# EasyEDA Pro project ProProject_ONGEKI霍尔按键.epro

# Schematic Schematic1
Create Date: 2024-01-17; Page Name: P1; Project Name: ONGEKI霍尔按键; Schematic Name: Schematic1; Update Date: 2024-01-17; Company: 嘉立创EDA; Page Size: A4; Version: V1.0
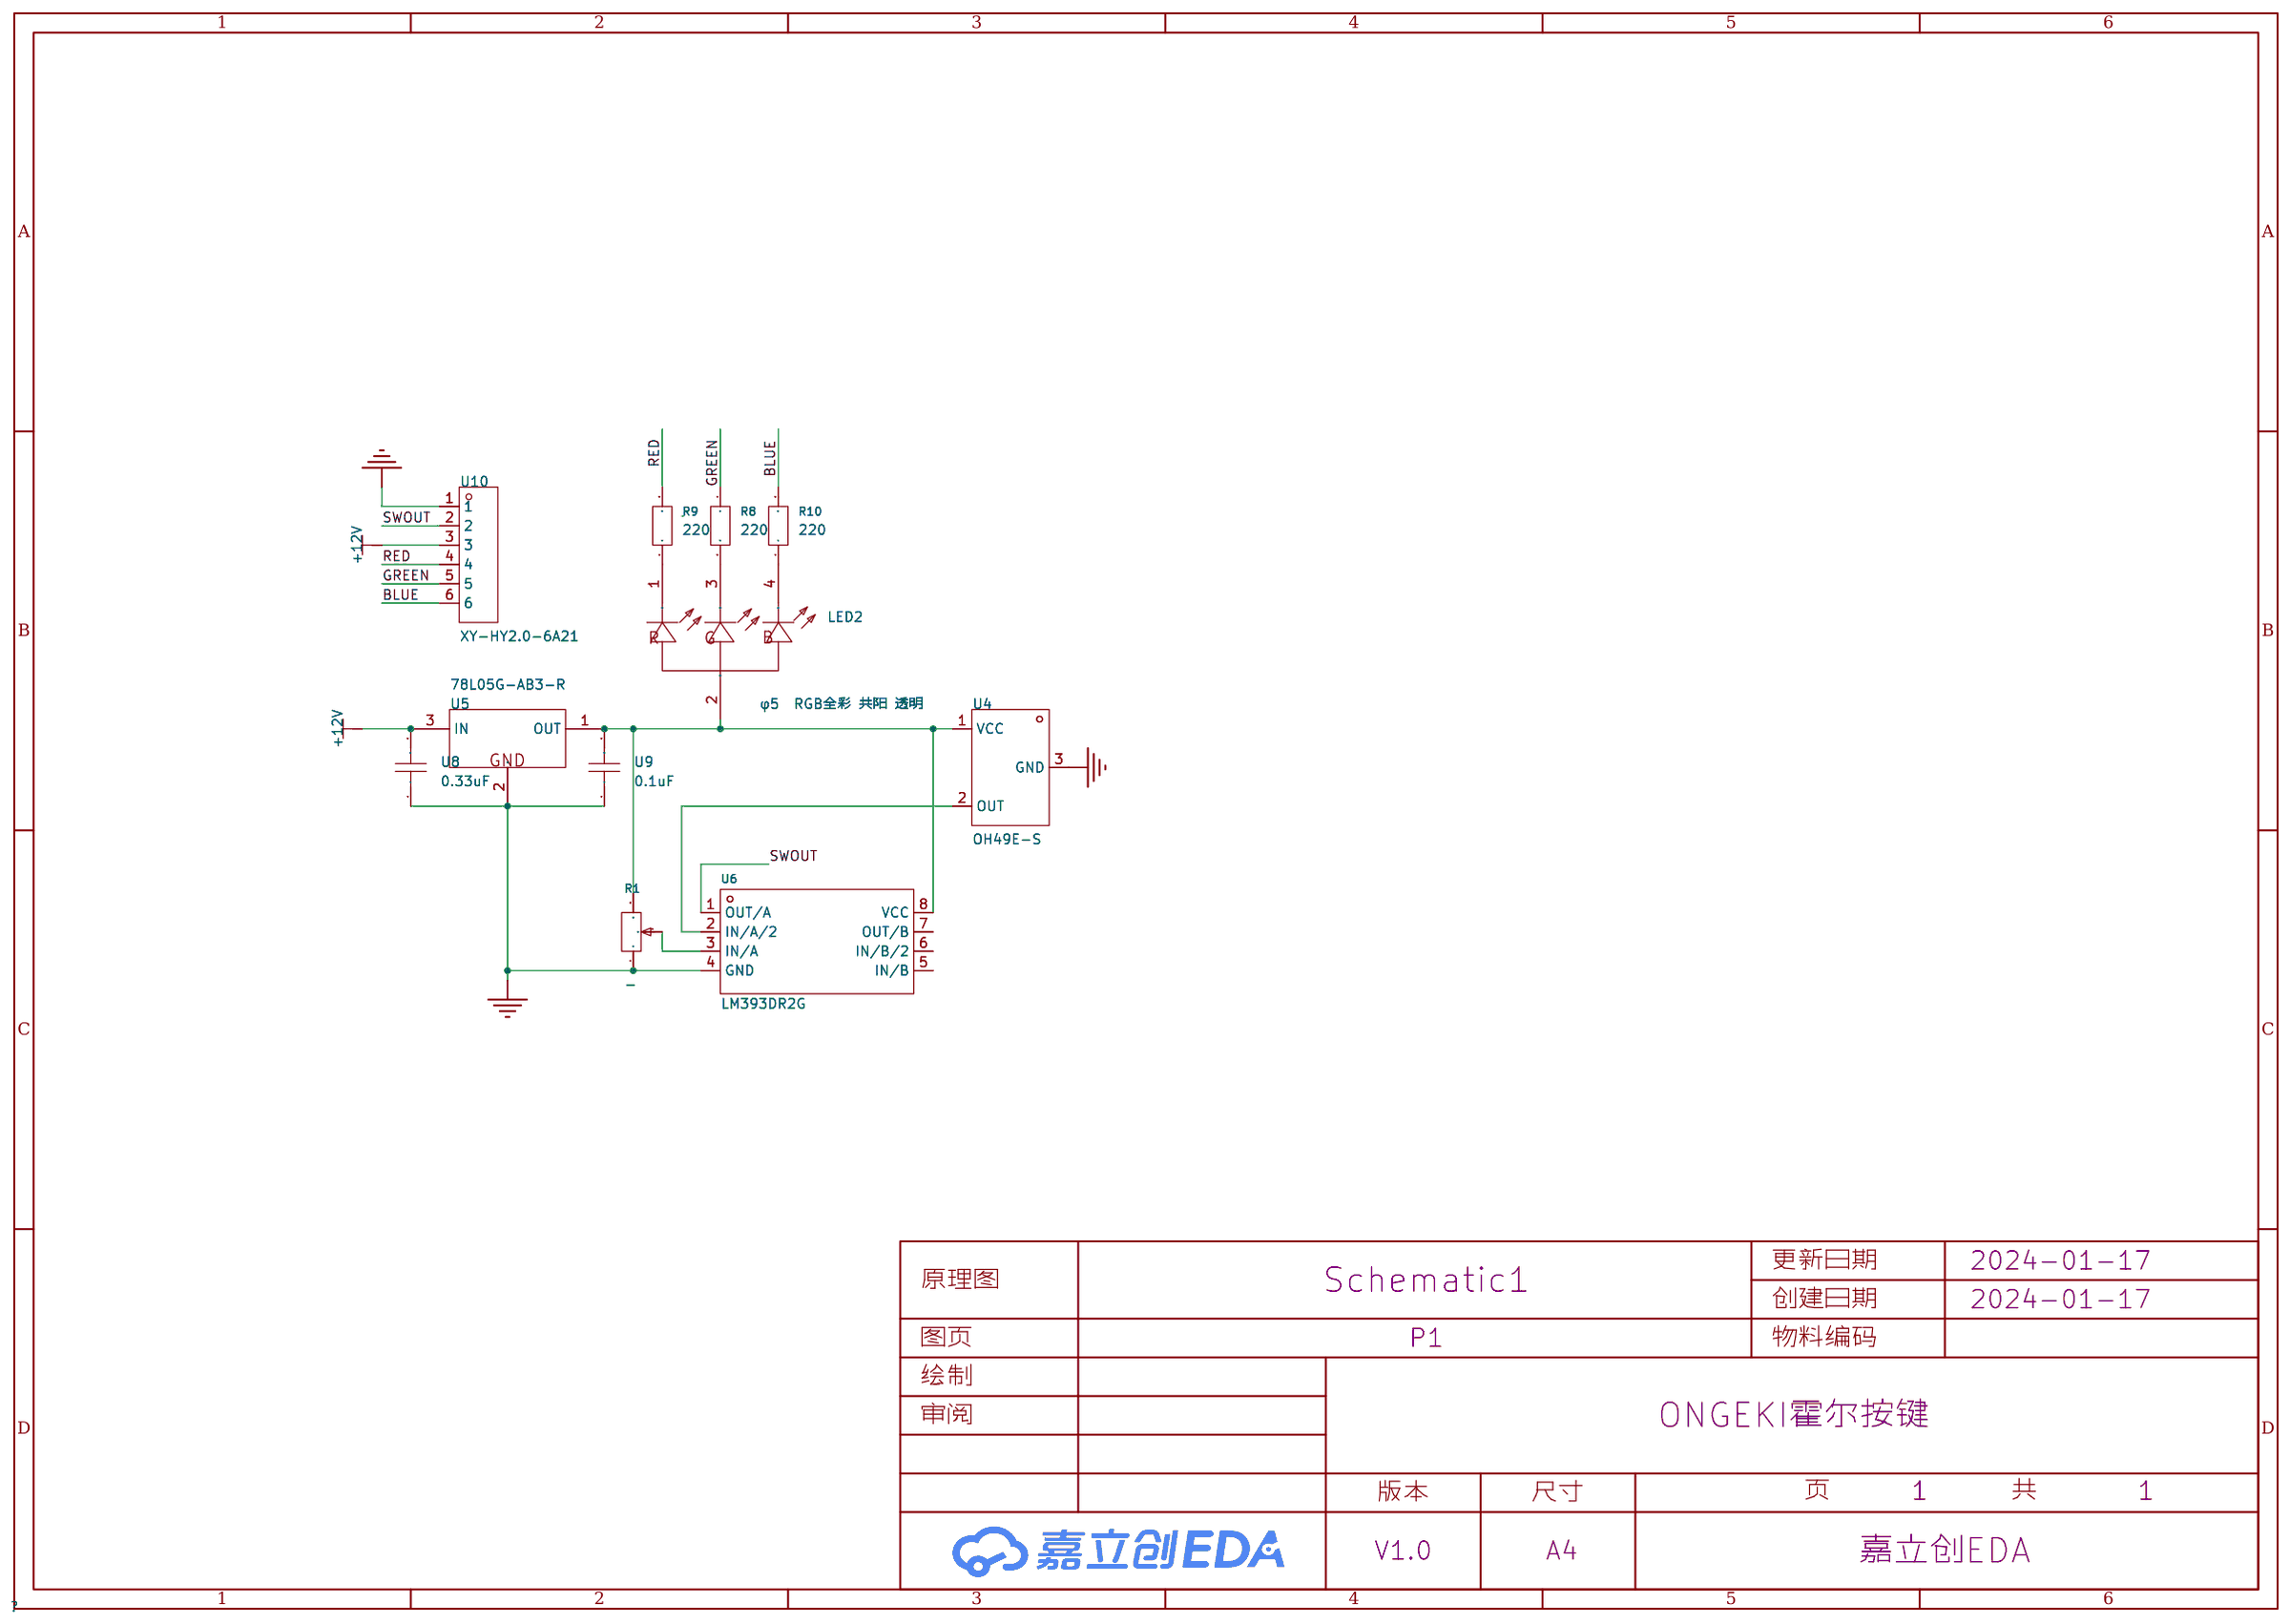
[diagram p0: schematic sheet]

## Parts
LED2  φ5  RGB全彩 共阳 透明  [LED-TH_4P-BD5.8-P1.30]
R1  -  [RES-ADJ-TH_3P-L9.5-W4.85-P2.50-BL-BS]
R8  220  [R0603]
R9  220  [R0603]
R10  220  [R0603]
U4  OH49E-S  [SOT-23-3_L2.9-W1.6-P1.90-LS2.8-BR]
U5  78L05G-AB3-R  [SOT-89-3_L4.5-W2.5-P1.50-LS4.2-BR]
U6  LM393DR2G  [SOIC-8_L5.0-W4.0-P1.27-LS6.0-BL]
U8  0.33uF  [C0805]
U9  0.1uF  [C0805]
U10  XY-HY2.0-6A21  [HDR-TH_6P-P2.00-H-F]

## Library data of the parts
LED2 = φ5  RGB全彩 共阳 透明: 主波长/色坐标:620~625nm红,515~520nm绿,460~465nm蓝;照明颜色:RGB三色;; LCSC Part Name: 共阳极RGB三色发光二极管; Supplier Part: C32985; Supplier Footprint: Through Hole 5mm; JLCPCB Part Class: 扩展库; Datasheet: https://atta.szlcsc.com/upload/public/pdf/source/20160528/1464426879961.pdf; Supplier: LCSC
R1 = 3296W-1-105_C5027: 阻值:-;功率:-;; LCSC Part Name: 1MΩ ±0.25% ±250ppm/℃; Supplier Part: C5027; Manufacturer Part: 3296W-1-105; Supplier Footprint: 3296W; JLCPCB Part Class: 扩展库; Supplier: LCSC
R8-R10 = SCR0603F1K: 阻值:1kΩ;精度:±1%;; LCSC Part Name: 1kΩ ±1%; Supplier Part: C3016283; Manufacturer: VO(翔胜); Supplier Footprint: 0603; JLCPCB Part Class: 扩展库; Datasheet: https://atta.szlcsc.com/upload/public/pdf/source/20220513/247AF9639BA21CF93567DC289CCC6A22.pdf; Supplier: LCSC; Tolerance: ±1%
U4 = OH49E-S: LCSC Part Name: 线性霍尔开关电路; Supplier Part: C85573; Manufacturer: 南京欧卓; Supplier Footprint: SOT-23; JLCPCB Part Class: Extended Part; Datasheet: https://atta.szlcsc.com/upload/public/pdf/source/20170824/C85573_1503566162060907583.pdf; Supplier: LCSC
U5 = 78L05G-AB3-R: 输出类型:固定;输出极性:正;输出通道数:1;最大输入电压:30V;输出电压:5V;压差:1.7V@(40mA);输出电流:100mA;; LCSC Part Name: 正 Vin=30V Vout=5V 100mA; Supplier Part: C71136; Manufacturer: UTC(友顺); Supplier Footprint: SOT-89(SOT-89-3); JLCPCB Part Class: Basic Part; Datasheet: https://atta.szlcsc.com/upload/public/pdf/source/20160416/1460799394329.pdf; Supplier: LCSC; Output Type: 固定; Output Polarity: 正; Number of Outputs: 1; Maximum Input Voltage: 30V; Output Voltage: 5V; Dropout Voltage: 1.7V@(40mA); Output Current: 100mA
U6 = LM393DR2G: 比较器组数:2;输入失调电压(Vos):5mV;输入偏置电流(Ib):250nA;; LCSC Part Name: 比较器，双，低偏移电压; Supplier Part: C7955; Manufacturer: onsemi(安森美); Supplier Footprint: SOP-8; JLCPCB Part Class: Basic Part; Datasheet: https://atta.szlcsc.com/upload/public/pdf/source/20140815/1457707223499.pdf; Supplier: LCSC; Number of Elements: 2; Input Offset Voltage (Vos): 5mV; Input Bias Current (Ib): 250nA; Output Type: 开集；轨到轨; Supply Current: 2.5mA; Supply Voltage: 1V~18V；2V~36V; Operating Temperature: 0℃~+70℃
U8 U9 = C0805X300M4HAC7800: 容值:30pF;精度:±20%;额定电压:16V;材质(温度系数):X8R;; LCSC Part Name: 30pF ±20% 16V; Supplier Part: C2191063; Manufacturer: KEMET(基美); Supplier Footprint: 0805; JLCPCB Part Class: 扩展库; Datasheet: https://atta.szlcsc.com/upload/public/pdf/source/20210401/5E5AB739708614F1786732FB20AFC9B1.pdf; Supplier: LCSC; Tolerance: ±20%; Voltage Rated: 16V; Temperature Coefficient: X8R
U10 = XY-HY2.0-6A21: 插针结构:1x6P;间距:2mm;安装方式:弯插;总PIN数:6P;排数:1;每排PIN数:6;行距:2mm;额定电流:2A;工作温度范围:-25℃~+85℃;; LCSC Part Name: 1x6P 间距:2mm 弯插; Supplier Part: C19271363; Manufacturer: XYECONN(辛译); Supplier Footprint: 弯插,P=2mm; Datasheet: https://atta.szlcsc.com/upload/public/pdf/source/20231124/B3CD161F8690218A5AD77E574BE87AD3.pdf; Supplier: LCSC; Pins Structure: 1x6P; Pitch: 2mm; Mounting Style: 弯插; Number of Pins: 6P; Number of Rows: 1; Number of PINs Per Row: 6; Row Spacing: 2mm; Current Rating (Max): 2A; Operating Temperature Range: -25℃~+85℃

## Nets
+12V: U5.3(IN) U8.2 U10.3
GND: R1.1 U4.3(GND) U5.2(GND) U6.4(GND) U8.1 U9.1 U10.1
BLUE: R10.2 U10.6
GREEN: R8.1 U10.5
RED: R9.2 U10.4
SWOUT: U6.1(OUT/A) U10.2
$1N410: U4.2(OUT) U6.2(IN/A/2)
$1N563: R1.2 U6.3(IN/A)
$1N1271: LED2.2(CA) R1.3 U4.1(VCC) U5.1(OUT) U6.8(VCC) U9.2
$1N1286: LED2.3(KG) R8.2
$1N1288: LED2.4(KB) R10.1
$1N1290: LED2.1(KR) R9.1

Not connected (* = marked no-connect by the designer): U6 5(IN/B) 6(IN/B/2) 7(OUT/B)

# Board PCB1
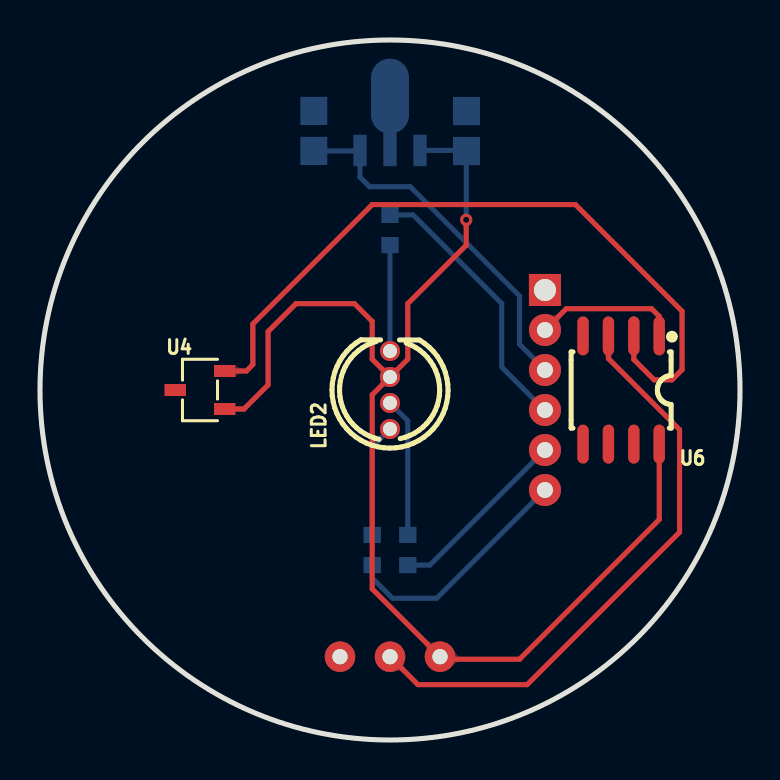
[diagram p1: board, top side]
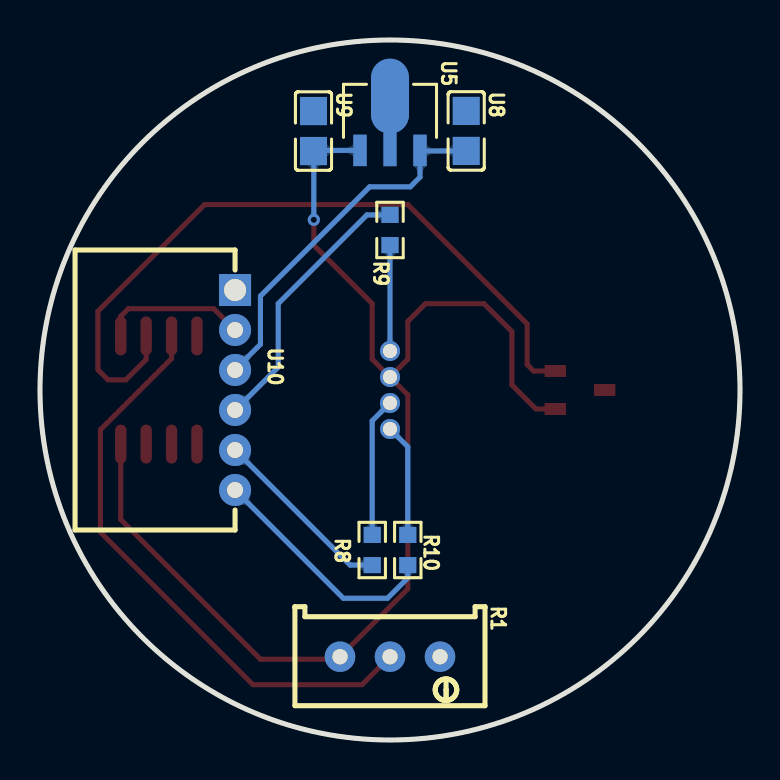
[diagram p2: board, bottom side, seen from below]

Outline 35 x 35 mm; copper layers: Top Layer, Bottom Layer. Coordinates in mm from the lower left corner of the outline.
Outline path: circle c17.5,17.5 r17.5
Stack: Top Layer 0.035mm / Dielectric1 1.51mm FR4 er 4.5 / Bottom Layer 0.035mm

## Design rules (mm)
template: JLCPCB Capability(Two Layers Board)
spacing copperThickness1oz (default): track to track 0.102, other pairs 0.152 to 0.3
spacing copperThickness2oz: track to track 0.203, other pairs 0.152 to 0.3
track width copperThickness1oz (default): min 0.127, default 0.254, max 2.54
track width copperThickness2oz: min 0.203, default 0.254, max 2.54
differential pair differentialPair (default): width min 0.127, default 0.254, max 2.54; gap min 0.152, default 0.152
via viaSize (default): diameter min 0.5, default 0.61, max 10; hole min 0.3, default 0.305, max 6.3

## Placement (name value [footprint] x y rotation side)
LED2  φ5  RGB全彩 共阳 透明  [LED-TH_4P-BD5.8-P1.30]  17.5 17.5 90 top
R1  -  [RES-ADJ-TH_3P-L9.5-W4.85-P2.50-BL-BS]  17.5 4.17 270 bottom
R8  220  [R0603]  18.39 9.5 90 bottom
R9  220  [R0603]  17.5 25.5 90 bottom
R10  220  [R0603]  16.61 9.5 270 bottom
U4  OH49E-S  [SOT-23-3_L2.9-W1.6-P1.90-LS2.8-BR]  8 17.5 0 top
U5  78L05G-AB3-R  [SOT-89-3_L4.5-W2.5-P1.50-LS4.2-BR]  17.5 30.83 270 bottom
U6  LM393DR2G  [SOIC-8_L5.0-W4.0-P1.27-LS6.0-BL]  29.06 17.5 180 top
U8  0.33uF  [C0805]  13.69 30.45 270 bottom
U9  0.1uF  [C0805]  21.33 30.45 270 bottom
U10  XY-HY2.0-6A21  [HDR-TH_6P-P2.00-H-F]  25.25 17.5 270 bottom

## Footprints (pads in the part's own frame, mm; a bottom-side part is the same pattern mirrored in y, then rotated)
C0805
  rect 1.41x1.35 smd: 1(-1,0) 2(1,0)
HDR-TH_6P-P2.00-H-F
  rect 1.6x1.6 hole 1.1: 1(-5,0)
  round 1.6 hole 0.8: 2(-3,0) 3(-1,0) 4(1,0) 5(3,0) 6(5,0)
LED-TH_4P-BD5.8-P1.30
  round 1 hole 0.7: 1(1.95,0) 2(0.65,0) 3(-0.65,0) 4(-1.95,0)
R0603
  rect 0.806x0.864 smd: 1(-0.753,0) 2(0.753,0)
RES-ADJ-TH_3P-L9.5-W4.85-P2.50-BL-BS
  round 1.524 hole 0.762: 1(0,2.5) 2(0,0) 3(0,-2.5)
SOIC-8_L5.0-W4.0-P1.27-LS6.0-BL
  oval 0.569x1.95 smd: 1(-1.905,-2.705) 2(-0.635,-2.705) 3(0.635,-2.705) 4(1.905,-2.705) 5(1.905,2.705) 6(0.635,2.705) 7(-0.635,2.705) 8(-1.905,2.705)
SOT-23-3_L2.9-W1.6-P1.90-LS2.8-BR
  rect 1.07x0.6 smd: 1(1.235,-0.95) 2(1.235,0.95) 3(-1.235,0)
SOT-89-3_L4.5-W2.5-P1.50-LS4.2-BR
  rect 1.575x0.672 smd: 1(1.356,-1.5) 3(1.356,1.5)
  custom 5.377x1.9 smd: 2(-1.356,0)

## Nets
As in the schematic.

Pads without a net: U6 5 6 7

## Via types
v1: diameter 0.61, hole 0.305, Top Layer to Bottom Layer, 1 via

## Routing (per net, layer and track width the routed paths; a pad name or vN(x,y) marks a point on that pad's centre or on a via; arc(x,y) is an arc through that point)
+12V: length 18.3
  Bottom Layer w0.254: U8.2 15.97,29.45 U5.3 16,28.14 16.48,27.66 18.52,27.66 23.98,22.2 23.98,19.79 25.25,18.52 U10.3
GND: length 1
  Bottom Layer w0.254: 16.76,31.45 17.5,32.19
BLUE: length 11.9
  Bottom Layer w0.254: R10.2 16.61,8.1 17.63,7.09 19.83,7.09 U10.6
GREEN: length 9.2
  Bottom Layer w0.254: R8.1 19.49,8.75 U10.5
RED: length 13.9
  Bottom Layer w0.254: R9.2 18.65,26.25 23.09,21.82 23.09,18.64 25.25,16.48 25.25,16.25
SWOUT: length 7.3
  Top Layer w0.254: U6.1 30.96,21.18 30.58,21.56 26.31,21.56 U10.2
$1N410: length 36.9
  Top Layer w0.254: U4.2 10.32,18.45 10.64,18.77 10.64,20.8 16.61,26.77 26.77,26.77 32.1,21.44 32.1,18.52 31.6,18.01 30.71,18.01 29.69,19.02 U6.2
$1N563: length 29.5
  Top Layer w0.254: R1.2 18.9,2.77 24.36,2.77 31.98,10.39 31.98,15.51 28.42,19.07 U6.3
$1N1271: length 63.3
  Top Layer w0.254: v1(21.31,26.01) 21.31,24.74 18.39,21.82 18.39,19.04 LED2.2 ; LED2.2 16.61,19.04 16.61,20.93 15.72,21.82 12.8,21.82 11.4,20.42 11.4,17.75 10.2,16.55 U4.1 ; LED2.2 16.61,17.26 16.61,7.55 R1.3 20.13,4.04 23.98,4.04 30.96,11.02 U6.8
  Bottom Layer w0.254: U5.1 21.29,29.48 U9.2 21.31,29.43 v1(21.31,26.01)
$1N1286: length 7
  Bottom Layer w0.254: R8.2 18.39,15.96 LED2.3
$1N1288: length 5.7
  Bottom Layer w0.254: R10.1 16.61,14.66 LED2.4
$1N1290: length 5.3
  Bottom Layer w0.254: LED2.1 R9.1

## Copper pours and planes (outline as drawn; the poured copper is in the pictures)
GND on Top Layer: 37.5,17.93 37.46,18.81 37.38,19.67 37.27,20.54 37.12,21.4 36.93,22.25 36.7,23.09 36.44,23.93 36.14,24.75 35.81,25.55 35.44,26.34 35.04,27.12 34.6,27.87 34.13,28.61 33.63,29.32 33.1,30.02 32.54,30.68 31.95,31.33 31.33,31.94 30.69,32.53 30.02,33.09 29.33,33.63 28.61,34.13 27.88,34.6 27.12,35.03 26.35,35.43 25.56,35.8 24.75,36.14 23.93,36.44 23.1,36.7 22.25,36.92 21.4,37.11 20.54,37.26 19.68,37.38 18.81,37.45 17.94,37.49 17.06,37.49 16.19,37.45 15.32,37.38 14.46,37.26 13.6,37.11 12.75,36.92 11.9,36.7 11.07,36.44 10.25,36.14 9.45,35.8 8.66,35.43 7.88,35.03 7.13,34.6 6.39,34.13 5.67,33.63 4.98,33.09 4.31,32.53 3.67,31.94 3.05,31.33 2.46,30.68 1.9,30.02 1.37,29.32 0.87,28.61 0.4,27.87 -0.03,27.12 -0.44,26.34 -0.81,25.55 -1.14,24.75 -1.44,23.93 -1.7,23.09 -1.93,22.25 -2.11,21.4 -2.27,20.54 -2.38,19.67 -2.46,18.81 -2.49,17.93 -2.49,17.06 -2.46,16.19 -2.38,15.32 -2.27,14.45 -2.11,13.6 -1.93,12.74 -1.7,11.9 -1.44,11.07 -1.14,10.25 -0.81,9.44 -0.44,8.65 -0.03,7.88 0.4,7.12 0.87,6.39 1.37,5.67 1.9,4.98 2.46,4.31 3.05,3.67 3.67,3.05 4.31,2.46 4.98,1.9 5.67,1.37 6.39,0.87 7.13,0.4 7.88,-0.04 8.66,-0.44 9.45,-0.81 10.25,-1.14 11.07,-1.44 11.9,-1.7 12.75,-1.93 13.6,-2.12 14.46,-2.27 15.32,-2.38 16.19,-2.46 17.06,-2.5 17.94,-2.5 18.81,-2.46 19.68,-2.38 20.54,-2.27 21.4,-2.12 22.25,-1.93 23.1,-1.7 23.93,-1.44 24.75,-1.14 25.56,-0.81 26.35,-0.44 27.12,-0.04 27.88,0.4 28.61,0.87 29.33,1.37 30.02,1.9 30.69,2.46 31.33,3.05 31.95,3.67 32.54,4.31 33.1,4.98 33.63,5.67 34.13,6.39 34.6,7.12 35.04,7.88 35.44,8.65 35.81,9.44 36.14,10.25 36.44,11.07 36.7,11.9 36.93,12.74 37.12,13.6 37.27,14.45 37.38,15.32 37.46,16.19 37.5,17.06
GND on Bottom Layer: 37.5,17.93 37.46,18.81 37.38,19.67 37.27,20.54 37.12,21.4 36.93,22.25 36.7,23.09 36.44,23.93 36.14,24.75 35.81,25.55 35.44,26.34 35.03,27.12 34.6,27.87 34.13,28.61 33.63,29.32 33.1,30.02 32.54,30.68 31.95,31.33 31.33,31.94 30.69,32.53 30.02,33.09 29.33,33.63 28.61,34.13 27.88,34.6 27.12,35.03 26.35,35.43 25.55,35.8 24.75,36.14 23.93,36.44 23.1,36.7 22.25,36.92 21.4,37.11 20.54,37.26 19.68,37.38 18.81,37.45 17.94,37.49 17.06,37.49 16.19,37.45 15.32,37.38 14.46,37.26 13.6,37.11 12.75,36.92 11.9,36.7 11.07,36.44 10.25,36.14 9.45,35.8 8.65,35.43 7.88,35.03 7.12,34.6 6.39,34.13 5.67,33.63 4.98,33.09 4.31,32.53 3.67,31.94 3.05,31.33 2.46,30.68 1.9,30.02 1.37,29.32 0.87,28.61 0.4,27.87 -0.03,27.12 -0.44,26.34 -0.81,25.55 -1.14,24.75 -1.44,23.93 -1.7,23.09 -1.93,22.25 -2.12,21.4 -2.27,20.54 -2.38,19.67 -2.46,18.81 -2.5,17.93 -2.5,17.06 -2.46,16.19 -2.38,15.32 -2.27,14.45 -2.12,13.6 -1.93,12.74 -1.7,11.9 -1.44,11.07 -1.14,10.25 -0.81,9.44 -0.44,8.65 -0.03,7.88 0.4,7.12 0.87,6.39 1.37,5.67 1.9,4.98 2.46,4.31 3.05,3.67 3.67,3.05 4.31,2.46 4.98,1.9 5.67,1.37 6.39,0.87 7.12,0.4 7.88,-0.04 8.65,-0.44 9.45,-0.81 10.25,-1.14 11.07,-1.44 11.9,-1.7 12.75,-1.93 13.6,-2.12 14.46,-2.27 15.32,-2.38 16.19,-2.46 17.06,-2.5 17.94,-2.5 18.81,-2.46 19.68,-2.38 20.54,-2.27 21.4,-2.12 22.25,-1.93 23.1,-1.7 23.93,-1.44 24.75,-1.14 25.55,-0.81 26.35,-0.44 27.12,-0.04 27.88,0.4 28.61,0.87 29.33,1.37 30.02,1.9 30.69,2.46 31.33,3.05 31.95,3.67 32.54,4.31 33.1,4.98 33.63,5.67 34.13,6.39 34.6,7.12 35.03,7.88 35.44,8.65 35.81,9.44 36.14,10.25 36.44,11.07 36.7,11.9 36.93,12.74 37.12,13.6 37.27,14.45 37.38,15.32 37.46,16.19 37.5,17.06

Small or netless copper shapes (teardrops, artwork), in the pictures only: 14 on Top Layer, 20 on Bottom Layer
